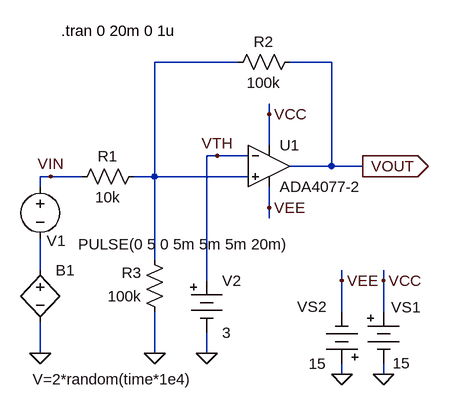
[diagram p0: schematic fig-01-03-19.asc]
fig-01-03-19.asc, the LTspice schematic file:
Version 4
SHEET 1 880 680
WIRE 160 16 32 16
WIRE 304 16 240 16
WIRE 208 96 208 80
WIRE 208 144 208 96
WIRE 128 160 112 160
WIRE 176 160 128 160
WIRE 304 176 304 16
WIRE 304 176 240 176
WIRE 352 176 304 176
WIRE -128 192 -144 192
WIRE -80 192 -128 192
WIRE 32 192 32 16
WIRE 32 192 0 192
WIRE 176 192 32 192
WIRE -144 208 -144 192
WIRE 208 240 208 208
WIRE 208 256 208 240
WIRE 32 320 32 192
WIRE -144 336 -144 288
WIRE 112 352 112 160
WIRE 320 352 320 336
WIRE 384 352 384 336
WIRE 320 400 320 352
WIRE 384 400 384 352
WIRE -144 464 -144 416
WIRE 32 464 32 400
WIRE 112 464 112 432
WIRE 320 496 320 480
WIRE 384 496 384 480
FLAG -144 464 0
FLAG -128 192 VIN
FLAG 320 496 0
FLAG 384 496 0
FLAG 320 352 VEE
FLAG 384 352 VCC
FLAG 208 96 VCC
FLAG 208 240 VEE
FLAG 112 464 0
FLAG 352 176 VOUT
IOPIN 352 176 Out
FLAG 128 160 VTH
FLAG 32 464 0
SYMBOL voltage -144 192 R0
WINDOW 0 10 99 Left 2
WINDOW 3 58 104 Left 2
WINDOW 123 0 0 Left 0
WINDOW 39 0 0 Left 0
SYMATTR InstName V1
SYMATTR Value PULSE(0 5 0 5m 5m 5m 20m)
SYMBOL Misc\\battery 384 384 R0
WINDOW 0 12 9 Left 2
WINDOW 3 14 95 Left 2
SYMATTR InstName VS1
SYMATTR Value 15
SYMBOL Misc\\battery 320 496 R180
WINDOW 0 24 104 Left 2
WINDOW 3 24 16 Left 2
SYMATTR InstName VS2
SYMATTR Value 15
SYMBOL Misc\\battery 112 336 R0
WINDOW 123 0 0 Left 0
WINDOW 39 0 0 Left 0
SYMATTR InstName V2
SYMATTR Value 3
SYMBOL bv -144 320 R0
WINDOW 3 -12 184 Left 2
SYMATTR Value V=2*random(time*1e4)
SYMATTR InstName B1
SYMBOL res 16 176 R90
WINDOW 0 0 56 VBottom 2
WINDOW 3 32 56 VTop 2
SYMATTR InstName R1
SYMATTR Value 10k
SYMBOL res 256 0 R90
WINDOW 0 0 56 VBottom 2
WINDOW 3 32 56 VTop 2
SYMATTR InstName R2
SYMATTR Value 100k
SYMBOL res 48 416 R180
WINDOW 0 36 76 Left 2
WINDOW 3 36 40 Left 2
SYMATTR InstName R3
SYMATTR Value 100k
SYMBOL Opamps\\ADA4077-2 208 112 R0
SYMATTR InstName U1
TEXT -112 -32 Left 2 !.tran 0 20m 0 1u

The netlist it stands for:
* fig-01-03-19.asc
V1 VIN N002 PULSE(0 5 0 5m 5m 5m 20m)
VS1 VCC 0 15
VS2 0 VEE 15
V2 VTH 0 3
B1 N002 0 V=2*random(time*1e4)
R1 N001 VIN 10k
R2 VOUT N001 100k
R3 0 N001 100k
XU1 N001 VTH VCC VEE VOUT ADA4077-2  ; pins In+ In- V+ V- OUT
.tran 0 20m 0 1u
.backanno
.end